# EAGLE design Main Titan V2 (EAGLE 9.4.2)
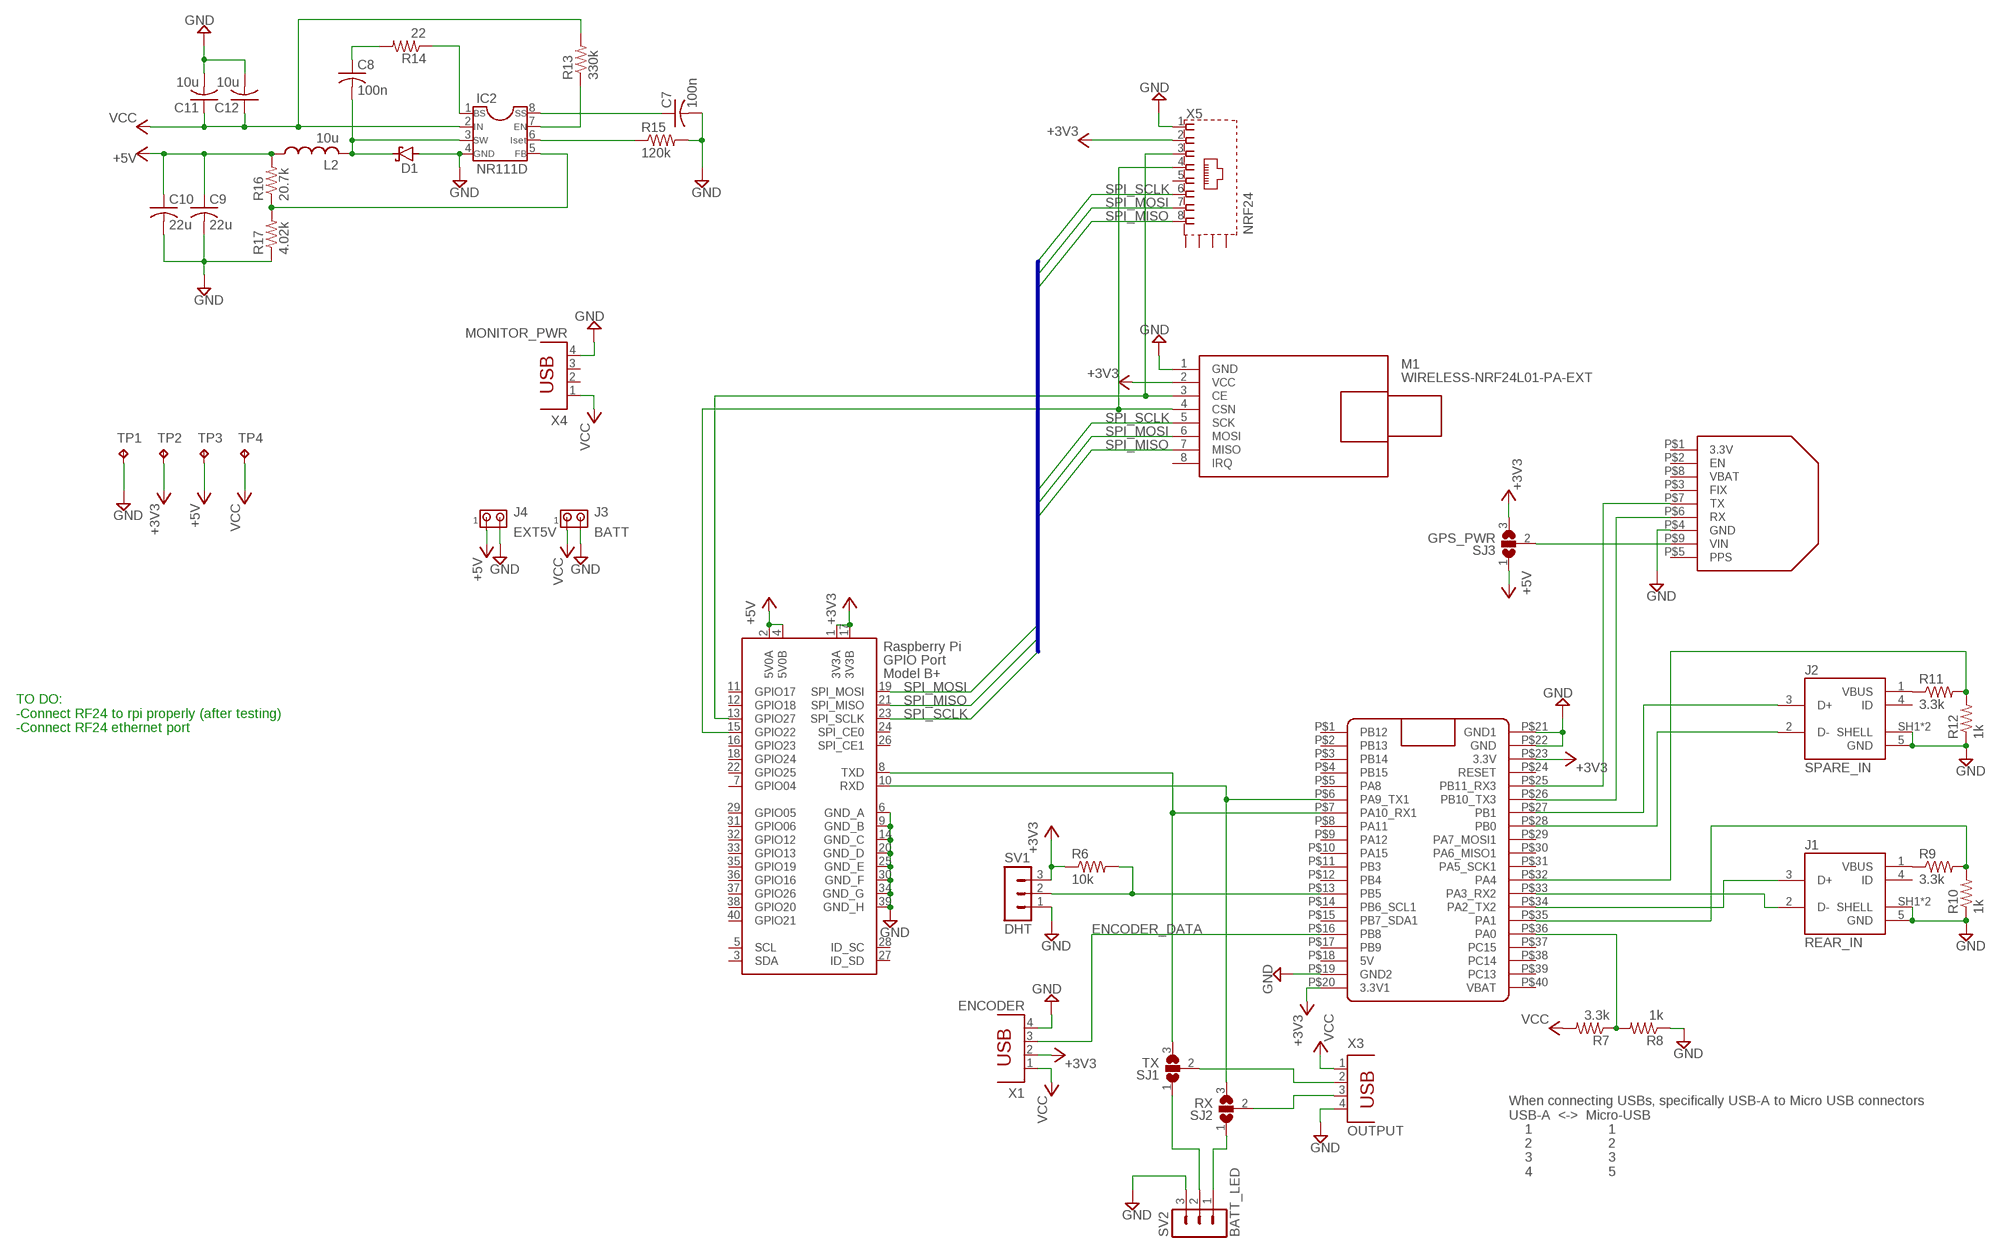
[diagram p0: schematic, sheet 1]

## Parts
C7  100n  C-US050-024X044  [C050-024X044]
C8  100n  C-US050-024X044  [C050-024X044]
C9  22u  C-US025-024X044  [C025-024X044]
C10  22u  C-US025-024X044  [C025-024X044]
C11  10u  C-US025-024X044  [C025-024X044]
C12  10u  C-US025-024X044  [C025-024X044]
D1  SCHOTTKY-DIODEC4111-15  [C4111-15]
IC2  NR111D  DIL8  [DIL08]
J1  REAR_IN  2172034-1  [TE_2172034-1]
J2  SPARE_IN  2172034-1  [TE_2172034-1]
J3  BATT  MTA02-156  [1X2MTA]
J4  EXT5V  MTA02-156  [1X2MTA]
L2  10u  WURTHINDUCTOR1  [INDRD650W105D880H1100B]
M1  WIRELESS-NRF24L01-PA-EXT  [WIRELESS-NRF24L01-PA-EXT]
R6  10k  R-US_0204/7  [0204/7]
R7  3.3k  R-US_0204/7  [0204/7]
R8  1k  R-US_0204/7  [0204/7]
R9  3.3k  R-US_0204/7  [0204/7]
R10  1k  R-US_0204/7  [0204/7]
R11  3.3k  R-US_0204/7  [0204/7]
R12  1k  R-US_0204/7  [0204/7]
R13  330k  R-US_0204/7  [0204/7]
R14  22  R-US_0204/7  [0204/7]
R15  120k  R-US_0204/7  [0204/7]
R16  20.7k  R-US_0204/7  [0204/7]
R17  4.02k  R-US_0204/7  [0204/7]
SJ1  TX  SJ2W  [SJ_2]
SJ2  RX  SJ2W  [SJ_2]
SJ3  GPS_PWR  SJ2W  [SJ_2]
SV1  DHT  MA03-1  [MA03-1]
SV2  BATT_LED  MA03-1  [MA03-1]
TP1  GND  TPTP20SQ  [TP20SQ]
TP2  3V3  TPTP20SQ  [TP20SQ]
TP3  5V  TPTP20SQ  [TP20SQ]
TP4  BAT  TPTP20SQ  [TP20SQ]
U$1  BLUE_PILL  [BLUE_PILL]
U$3  ULTIMATE-GPS  [ULTIMATE_GPS]
X1  ENCODER  PN87520  [PN87520]
X2  RPI  RASPI_GPIO_B+#_BOX  [RASPI_GPIO_B+_BOX]
X3  OUTPUT  PN87520  [PN87520]
X4  MONITOR_PWR  PN87520  [PN87520]
X5  NRF24  RJ45-6L21-S  [RJ45-SHIELD1]

## Nets
25%LED: SJ1.1 SV2.2
50%LED: SJ2.1 SV2.1
+3V3: M1.2(VCC) R6.1 SJ3.3 SV1.3 TP2.TP U$1.P$20(3.3V1) U$1.P$23(3.3V) X1.2 X2.1(3V3A) X2.17(3V3B) X5.2
+5V: C9.1 C10.1 J4.1 L2.1 R16.2 SJ3.1 TP3.TP X2.2(5V0A) X2.4(5V0B)
BATT_LVL: R7.1 R8.2 U$1.P$36(PA0)
DHT: R6.2 SV1.2 U$1.P$13(PB5)
ENCODER_DATA: U$1.P$16(PB8) X1.3
GND: C7.2 C9.2 C10.2 C11.2 C12.2 D1.A IC2.4(GND) J1.5(GND) J1.SH1(SHELL) J1.SH2(SHELL) J2.5(GND) J2.SH1(SHELL) J2.SH2(SHELL) J3.2 J4.2 M1.1(GND) R8.1 R10.1 R12.1 R15.2 R17.1 SV1.1 SV2.3 TP1.TP U$1.P$19(GND2) U$1.P$21(GND1) U$1.P$22(GND) U$3.P$4(GND) X1.4 X2.6(GND_A) X2.9(GND_B) X2.14(GND_C) X2.20(GND_D) X2.25(GND_E) X2.30(GND_F) X2.34(GND_G) X2.39(GND_H) X3.4 X4.4 X5.1
GPS_RX: U$1.P$26(PB10_TX3) U$3.P$6(RX)
GPS_TX: U$1.P$25(PB11_RX3) U$3.P$7(TX)
N$1: M1.3(CE) X2.13(GPIO27) X5.3
N$2: M1.4(CSN) X2.15(GPIO22) X5.4
N$3: SJ1.2 X3.2
N$4: SJ3.2 U$3.P$9(VIN)
N$5: SJ2.2 X3.3
N$14: IC2.5(FB) R16.1 R17.2
N$15: J1.1(VBUS) R9.1
N$17: J2.1(VBUS) R11.1
N$19: C8.2 D1.C IC2.3(SW) L2.2
N$22: C8.1 R14.2
N$23: C7.1 IC2.8(SS)
N$24: IC2.6(ISET) R15.1
N$25: IC2.7(EN) R13.1
N$26: IC2.1(BS) R14.1
REARBATT: R9.2 R10.2 U$1.P$35(PA1)
REARRX: J1.3(D+) U$1.P$34(PA2_TX2)
REARTX: J1.2(D-) U$1.P$33(PA3_RX2)
RPI_RX: SJ2.3 U$1.P$6(PA9_TX1) X2.10(RXD)
RPI_TX: SJ1.3 U$1.P$7(PA10_RX1) X2.8(TXD)
SPAREBATT: R11.2 R12.2 U$1.P$32(PA4)
SPARELED1: J2.3(D+) U$1.P$27(PB1)
SPARELED2: J2.2(D-) U$1.P$28(PB0)
SPI_MISO: M1.7(MISO) X2.21(SPI_MISO) X5.8
SPI_MOSI: M1.6(MOSI) X2.19(SPI_MOSI) X5.7
SPI_SCLK: M1.5(SCK) X2.23(SPI_SCLK) X5.6
VCC: C11.1 C12.1 IC2.2(IN) J3.1 R7.2 R13.2 TP4.TP X1.1 X3.1 X4.1
Unconnected: J1.4(ID) J2.4(ID) M1.8(IRQ) U$1.P$1(PB12) U$1.P$2(PB13) U$1.P$3(PB14) U$1.P$4(PB15) U$1.P$5(PA8) U$1.P$8(PA11) U$1.P$9(PA12) U$1.P$10(PA15) U$1.P$11(PB3) U$1.P$12(PB4) U$1.P$14(PB6_SCL1) U$1.P$15(PB7_SDA1) U$1.P$17(PB9) U$1.P$18(5V) U$1.P$24(RESET) U$1.P$29(PA7_MOSI1) U$1.P$30(PA6_MISO1) U$1.P$31(PA5_SCK1) U$1.P$37(PC15) U$1.P$38(PC14) U$1.P$39(PC13) U$1.P$40(VBAT) U$3.P$2(EN) U$3.P$3(FIX) U$3.P$5(PPS) U$3.P$8(VBAT) X2.3(SDA) X2.5(SCL) X2.7(GPIO04) X2.11(GPIO17) X2.12(GPIO18) X2.16(GPIO23) X2.18(GPIO24) X2.22(GPIO25) X2.24(SPI_CE0) X2.26(SPI_CE1) X2.27(ID_SD) X2.28(ID_SC) X2.29(GPIO05) X2.31(GPIO06) X2.32(GPIO12) X2.33(GPIO13) X2.35(GPIO19) X2.36(GPIO16) X2.37(GPIO26) X2.38(GPIO20) X2.40(GPIO21) X4.2 X4.3 X5.5 X5.S1(S) X5.S2(S) X5.S3(S) X5.S4(S)

## Buses
SPI_MISO,SPI_MOSI,SPI_SCLK

## Notes on the sheet
- TO DO:
  -Connect RF24 to rpi properly (after testing)
  -Connect RF24 ethernet port
- When connecting USBs, specifically USB-A to Micro USB connectors
  USB-A  <->  Micro-USB
      1                   1
      2                   2
      3                   3
      4                   5

## Power pins joined to a net without a drawn wire
3.3V: U$3.P$1(3.3V)

## Library data of the parts
C7-C12 = rcl:C-US: CAPACITOR, American symbol; SPICEPREFIX: C
D1 = diode:SCHOTTKY-DIODE: Schottky Diode
IC2 = NR111D:DIL8: Dual In Line / Socket
J1 J2 = 2172034-1:2172034-1: CONN RCPT USB MINI B 2.0 PCB R/A; COMMENT: 2172034-1; DESCRIPTION: Conn Mini USB Type B RCP 5 POS 0.8mm Solder RA Thru-Hole 5 Terminal 1 Port Box/Tray; DIGI-KEY_PART_NUMBER: A135698-ND; DIGI-KEY_PURCHASE_URL: https://www.digikey.com/product-detail/en/te-connectivity-amp-connectors/2172034-1/A135698-ND/5592056?utm_source=snapeda&utm_medium=aggregator&utm_campaign=symbol; EU_ROHS_COMPLIANCE: Compliant; MF: TE Connectivity; MP: 2172034-1; PACKAGE: None; TE_PURCHASE_URL: https://www.te.com/usa-en/product-2172034-1.html?te_bu=Cor&te_type=disp&te_campaign=seda_glo_cor-seda-global-disp-prtnr-fy19-seda-model-bom-cta_sma-317_1&elqCampaignId=32493
J3 J4 = con-amp:MTA02-156: AMP connector
L2 = NR111D:WURTHINDUCTOR
M1 = diy-modules:WIRELESS-NRF24L01-PA-EXT: 2.4 GHz Wireless Module based on NRF24L01 chip with preamplifier and external antenna Click here to find device on ebay.com <http://www.ebay.com/sch/nrf24l01+pa+lna+sma>
R6-R17 = rcl:R-US_: RESISTOR, American symbol; SPICEPREFIX: R
SJ1-SJ3 = jumper:SJ2W: SMD solder JUMPER
SV1 SV2 = con-lstb:MA03-1: PIN HEADER; OC_FARNELL: unknown; OC_NEWARK: unknown
TP1-TP4 = testpad:TP: Test pad
U$1 = BluePill:BLUE_PILL
U$3 = diy-modules:ULTIMATE-GPS
X1 X3 X4 = con-berg:PN87520: BERG USB connector; OC_FARNELL: unknown; OC_NEWARK: unknown
X2 = raspberrypi_bastelstube_v13:RASPI_GPIO_B+#: 2x20 header connector, all pins connected
X5 = con-tycoelectronics:RJ45*2: RJ45 Low Profile Shield Type 2 For all RJ45 L, LC, LCT and X Series Models Source: www.tycoelectronics.com .. ENG_DS_1654001_1099_RJ_L_0507.pdf; OC_FARNELL: unknown; OC_NEWARK: unknown

## Board
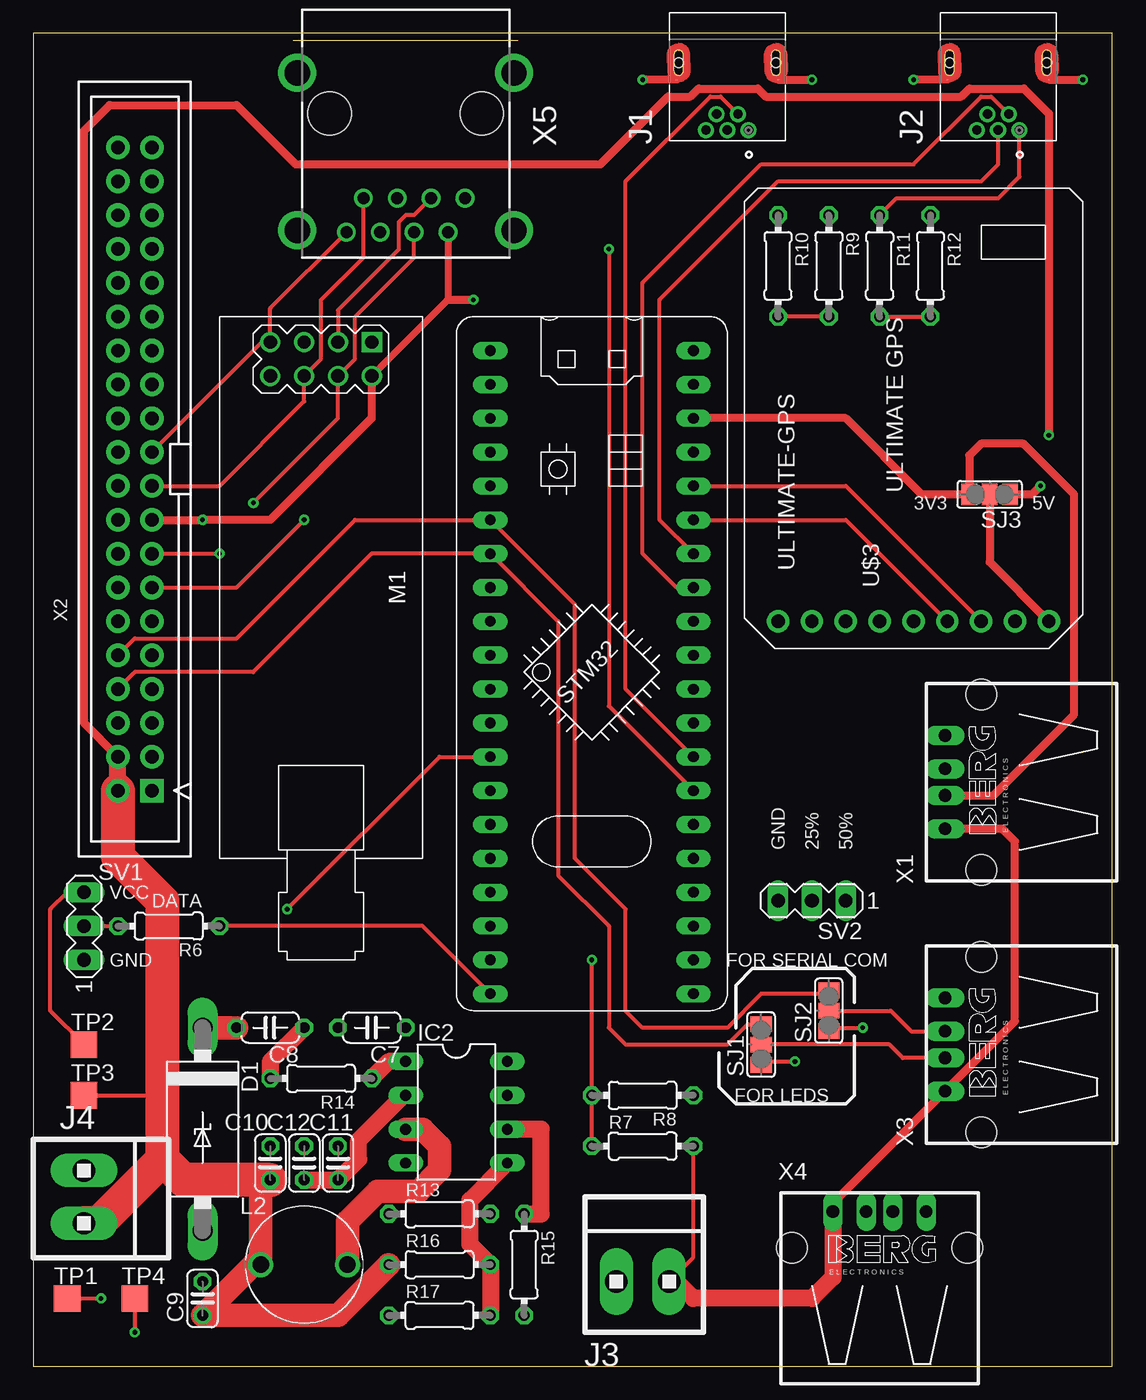
[diagram p1: board, top side]
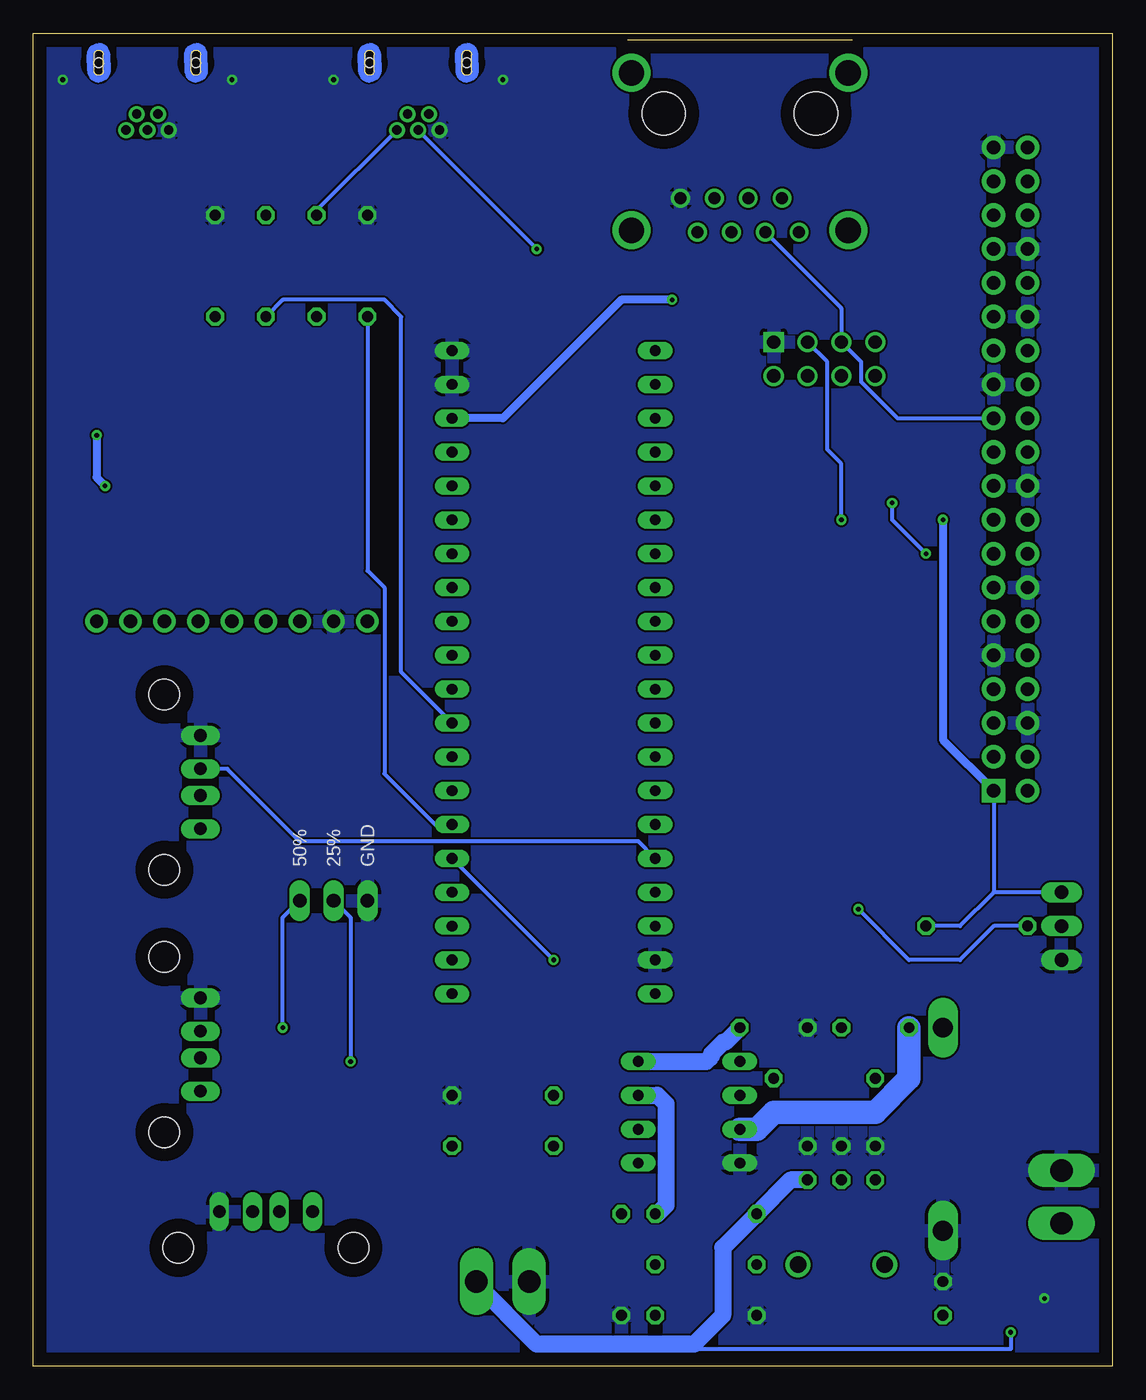
[diagram p2: board, bottom side, seen from below]

Size 80.95 x 100 mm. Coordinates in mm from the lower left corner, seen from the top.
Outline: 0,0 80.95,0 80.95,100 0,100 0,0
Copper layers (1*16): Top 0.035mm / dielectric 1.5mm / Bottom 0.035mm
Design rules "default": minimum track width 6mil, minimum drill 0.35mm, track to track 6mil, track to pad 6mil, pad to pad 6mil, via to via 6mil, smd to smd 6mil, copper to edge 40mil, drill to drill 6mil, minimum pad ring 10mil, minimum via ring 8mil, stop-mask expansion 4mil, vias tented up to drill 0mil, thermal gap 10mil

### Footprints (pad centres in the part's own frame; a part is rotated, then mirrored left to right if it is on the bottom)
C050-024X044 = drill 0.813 octagon: 1 -2.54,0; 2 2.54,0
C025-024X044 = drill 0.813 octagon: 1 -1.27,0; 2 1.27,0
C4111-15 = drill 1.499 long: A 7.62,0; C -7.62,0
DIL08 = drill 0.813 long: 1 -3.81,-3.81; 2 -1.27,-3.81; 3 1.27,-3.81; 4 3.81,-3.81; 5 3.81,3.81; 6 1.27,3.81; 7 -1.27,3.81; 8 -3.81,3.81
TE_2172034-1 = drill 0.7: 1 -5.05,-1.6; 2 -3.85,-0.8; 3 -5.05,0; 4 -3.85,0.8; 5 -5.05,1.6 | smd 0.1 x 0.1: SH1 -1.27,3.81; SH2 -1.27,-3.81 | hole 0.7: 0,3.65; 0,-3.65
1X2MTA = drill 1.676 long: 1 1.981,0; 2 -1.981,0
INDRD650W105D880H1100B = drill 1.25 pad 1.875: 1 -3.25,0; 2 3.25,0
WIRELESS-NRF24L01-PA-EXT = drill 1 square: 1 -18.415,3.81 | drill 1: 2 -15.875,3.81; 3 -18.415,1.27; 4 -15.875,1.27; 5 -18.415,-1.27; 6 -15.875,-1.27; 7 -18.415,-3.81; 8 -15.875,-3.81
0204/7 = drill 0.813 octagon: 1 -3.81,0; 2 3.81,0
SJ_2 = smd 1.168 x 1.6: 1 -1.524,0; 2 0,0; 3 1.524,0
MA03-1 = drill 1.016 long: 1 -2.54,0; 2 0,0; 3 2.54,0
TP20SQ = smd 2 x 2: TP 0,0
BLUE_PILL = drill 0.8 long: P$1 -7.62,15.24; P$2 -7.62,12.7; P$3 -7.62,10.16; P$4 -7.62,7.62; P$5 -7.62,5.08; P$6 -7.62,2.54; P$7 -7.62,0; P$8 -7.62,-2.54; P$9 -7.62,-5.08; P$10 -7.62,-7.62; P$11 -7.62,-10.16; P$12 -7.62,-12.7; P$13 -7.62,-15.24; P$14 -7.62,-17.78; P$15 -7.62,-20.32; P$16 -7.62,-22.86; P$17 -7.62,-25.4; P$18 -7.62,-27.94; P$19 -7.62,-30.48; P$20 -7.62,-33.02; P$21 7.62,15.24; P$22 7.62,12.7; P$23 7.62,10.16; P$24 7.62,7.62; P$25 7.62,5.08; P$26 7.62,2.54; P$27 7.62,0; P$28 7.62,-2.54; P$29 7.62,-5.08; P$30 7.62,-7.62; P$31 7.62,-10.16; P$32 7.62,-12.7; P$33 7.62,-15.24; P$34 7.62,-17.78; P$35 7.62,-20.32; P$36 7.62,-22.86; P$37 7.62,-25.4; P$38 7.62,-27.94; P$39 7.62,-30.48; P$40 7.62,-33.02
ULTIMATE_GPS = drill 1 pad 1.676: P$1 0,0; P$2 0,2.54; P$3 0,5.08; P$4 0,7.62; P$5 0,10.16; P$6 0,-2.54; P$7 0,-5.08; P$8 0,-7.62; P$9 0,-10.16
PN87520 = drill 0.95 long: 1 -3.5,2.71; 2 -1,2.71; 3 1,2.71; 4 3.5,2.71 | hole 2.3: -6.57,0; 6.57,0
RASPI_GPIO_B+_BOX = drill 1 pad 1.778 square: 1 -24.13,-1.27 | drill 1 pad 1.778: 2 -24.13,1.27; 3 -21.59,-1.27; 4 -21.59,1.27; 5 -19.05,-1.27; 6 -19.05,1.27; 7 -16.51,-1.27; 8 -16.51,1.27; 9 -13.97,-1.27; 10 -13.97,1.27; 11 -11.43,-1.27; 12 -11.43,1.27; 13 -8.89,-1.27; 14 -8.89,1.27; 15 -6.35,-1.27; 16 -6.35,1.27; 17 -3.81,-1.27; 18 -3.81,1.27; 19 -1.27,-1.27; 20 -1.27,1.27; 21 1.27,-1.27; 22 1.27,1.27; 23 3.81,-1.27; 24 3.81,1.27; 25 6.35,-1.27; 26 6.35,1.27; 27 8.89,-1.27; 28 8.89,1.27; 29 11.43,-1.27; 30 11.43,1.27; 31 13.97,-1.27; 32 13.97,1.27; 33 16.51,-1.27; 34 16.51,1.27; 35 19.05,-1.27; 36 19.05,1.27; 37 21.59,-1.27; 38 21.59,1.27; 39 24.13,-1.27; 40 24.13,1.27
RJ45-SHIELD1 = drill 0.9 pad 1.4: 1 -4.445,6.35; 2 -3.175,8.89; 3 -1.905,6.35; 4 -0.635,8.89; 5 0.635,6.35; 6 1.905,8.89; 7 3.175,6.35; 8 4.445,8.89 | drill 1.9 pad 2.5: S1 -8.128,-3.048; S2 8.128,-3.048; S3 -8.128,8.76; S4 8.128,8.76 | hole 3.251: -5.715,0; 5.715,0

### Placement (x,y rotation side)
C7  25.4,25.4 180 top
C8  17.78,25.4 180 top
C9  12.7,5.08 90 top
C10  17.78,15.24 90 top
C11  22.86,15.24 90 top
C12  20.32,15.24 90 top
D1  12.7,17.78 270 top
IC2  31.75,19.05 270 top
J1  52.07,97.79 90 top
J2  72.39,97.79 90 top
J3  45.72,6.35 0 top
J4  3.81,12.7 270 top
L2  20.32,7.62 0 top
M1  21.59,58.42 270 top
R6  10.16,33.02 180 top
R7  45.72,16.51 0 top
R8  45.72,20.32 180 top
R9  59.69,82.55 270 top
R10  55.88,82.55 270 top
R11  63.5,82.55 270 top
R12  67.31,82.55 270 top
R13  30.48,11.43 180 top
R14  21.59,21.59 180 top
R15  36.83,7.62 270 top
R16  30.48,7.62 180 top
R17  30.48,3.81 0 top
SJ1  54.61,24.13 90 top
SJ2  59.69,26.67 90 top
SJ3  71.75,65.41 180 top
SV1  3.81,33.02 90 top
SV2  58.42,34.92 180 top
TP1  2.54,5.08 0 top
TP2  3.81,24.13 0 top
TP3  3.81,20.32 0 top
TP4  7.62,5.08 0 top
U$1  41.91,60.96 0 top
U$3  66.04,55.88 90 top
X1  71.12,43.81 90 top
X2  7.62,67.31 90 top
X3  71.12,24.13 90 top
X4  63.5,8.89 0 top
X5  27.94,93.98 180 top

### Tracks (layer width: path | path; a pad name or v marks a point on that pad's centre or on a via)
25%LED  (via drill 0.35)
  Top 0.305: SJ1.1 54.86,22.86 v57.15,22.86
  Bottom 0.305: SV2.2 57.15,33.66 v57.15,22.86
50%LED  (via drill 0.35)
  Top 0.305: SJ2.1 59.94,25.4 v62.23,25.4
  Bottom 0.305: v62.23,25.4 62.23,33.66 SV2.1
+3V3  (via drill 0.35)
  Top 0.305: U$1.P$20 29.21,33.02 R6.1 | TP2.TP 1.27,26.67 1.27,34.29 2.54,35.56 SV1.3
  Top 0.508: M1.2 31.11,80.01 X5.2
  Top 0.61: M1.2 25.4,71.12 17.78,63.5 v12.7,63.5 X2.17 | U$1.P$23 60.96,71.12 66.67,65.41 SJ3.3 70.23,68.33 71.12,69.22 74.3,69.22 78.11,65.41 78.11,48.9 72.03,42.81 X1.2 | 31.11,80.01 v33.02,80.01
  Bottom 0.305: SV1.3 8.89,35.56 | R6.1 11.43,33.02 8.89,35.56 | X2.1 8.89,35.56
  Bottom 0.61: v12.7,63.5 12.7,46.99 X2.1 | v33.02,80.01 36.83,80.01 45.72,71.12 U$1.P$23
+5V  (via drill 0.35)
  Top 0.305: TP3.TP 9.7,20.32
  Top 0.61: X2.4 3.81,48.26 3.81,92.71 5.71,94.61 15.24,94.61 19.68,90.17 42.55,90.17 47.62,95.25 49.3,95.25 49.91,95.86 54.35,95.86 54.96,95.25 69.62,95.25 70.23,95.86 74.32,95.86 76.2,93.98 v76.2,69.85 | v75.56,66.04 74.93,65.41 SJ3.1
  Top 1.27: X2.2 X2.4 | L2.1 16.51,7.62
  Top 1.778: R16.2 22.86,3.81 C9.1 16.51,7.62 | L2.1 17.07,13.26 C10.1
  Top 2.54: J4.1 3.82,10.73 4.91,10.73 9.7,15.53 | 9.7,15.53 9.7,20.32 9.7,34.87 6.35,38.23 X2.2 | C10.1 11.26,13.97 9.7,15.53
  Bottom 0.61: v76.2,69.85 76.2,66.67 v75.56,66.04
BATT_LVL  (via drill 0.35)
  Top 0.305: R7.1 R8.2 v41.91,30.48
  Bottom 0.305: v41.91,30.48 U$1.P$36
DHT  (via drill 0.35)
  Top 0.305: SV1.2 R6.2 | v19.05,34.29 30.48,45.72 U$1.P$13
  Bottom 0.305: R6.2 8.89,33.02 11.43,30.48 15.24,30.48 v19.05,34.29
ENCODER_DATA
  Bottom 0.305: U$1.P$16 35.56,39.37 60.96,39.37 66.41,44.81 X1.3
GND  (via drill 0.35)
  Top 0.305: TP1.TP v5.08,5.08
  Top 0.61: J1.SH1 v45.72,96.52 | J1.SH2 v58.42,96.52 | J2.SH1 v66.04,96.52 | J2.SH2 v78.74,96.52
  pour Bottom: 0,100.33 0,0 82.55,0 82.55,100.33
GPS_RX
  Top 0.305: U$1.P$26 60.96,63.5 U$3.P$6
GPS_TX
  Top 0.305: U$1.P$25 60.96,66.04 U$3.P$7
N$1  (via drill 0.35)
  Top 0.305: X5.3 28.57,86.36 27.94,86.36 27.43,85.84 27.43,83.78 22.86,79.22 M1.3 | X2.13 15.24,58.42 v20.32,63.5
  Bottom 0.305: v20.32,63.5 20.32,67.72 21.38,68.78 21.38,75.35 M1.3
N$2  (via drill 0.35)
  Top 0.305: X5.4 28.57,83.19 24.13,78.74 24.13,75.56 M1.4 22.86,71.12 v16.51,64.77 | X2.15 v13.97,60.96
  Bottom 0.305: v13.97,60.96 16.51,63.5 v16.51,64.77
N$3
  Top 0.305: X3.2 65.23,23.13 64.23,24.13 SJ1.2
N$4
  Top 0.61: SJ3.2 71.75,60.33 U$3.P$9
N$5
  Top 0.305: SJ2.2 64.33,26.67 65.87,25.13 X3.3
N$14
  Top 1.27: R17.2 R16.1 32.77,9.14 32.77,12.45 IC2.5
N$15
  Bottom 0.305: J1.1 59.69,86.72 R9.1
N$17
  Top 0.305: R11.1 64.77,87.63 72.39,87.63 73.99,89.23 J2.1
N$19
  Top 1.778: C8.2 D1.C | L2.2 23.57,10.87 25.83,13.13 28.9,13.13 30.48,14.71 30.48,16.51 29.21,17.78 IC2.3
  Bottom 1.778: C8.2 15.24,21.59 17.78,19.05 25.4,19.05 26.67,17.78 IC2.3
N$22
  Top 1.27: C8.1 17.78,22.86 R14.2
N$23
  Bottom 1.27: IC2.8 30.48,22.86 30.05,23.29 30.05,23.46 29.2,24.31 29.03,24.31 C7.1
N$24
  Top 1.27: R15.1 38.1,11.43 38.1,17.78 IC2.6
N$25
  Bottom 1.27: R13.1 34.12,11.43 33.45,12.1 33.45,19.65 34.12,20.32 IC2.7
N$26
  Top 1.27: IC2.1 26.67,22.86 R14.1
REARBATT
  Top 0.305: R9.2 R10.2
  Bottom 0.305: R10.2 55.88,59.69 54.61,58.42 54.61,44.45 50.8,40.64 U$1.P$35
REARRX  (via drill 0.35)
  Top 0.305: v43.18,83.82 43.18,49.53 U$1.P$34
  Bottom 0.305: J1.3 43.18,83.85 v43.18,83.82
REARTX
  Top 0.305: U$1.P$33 44.45,50.8 44.45,88.9 50.8,95.25 51.56,95.25 J1.2
RPI_RX
  Top 0.305: X2.10 7.62,54.61 15.24,54.61 24.13,63.5 U$1.P$6 40.64,57.15 40.64,38.1 44.45,34.29 44.45,26.67 45.72,25.4 52.07,25.4 54.61,27.94 59.44,27.94 SJ2.3
RPI_TX
  Top 0.305: X2.8 7.62,52.07 16.51,52.07 25.4,60.96 U$1.P$7 39.37,55.88 39.37,36.83 43.18,33.02 43.18,25.4 44.45,24.13 52.07,24.13 53.59,25.65 SJ1.3
SPAREBATT
  Top 0.305: R11.2 R12.2
  Bottom 0.305: U$1.P$32 53.34,52.07 53.34,78.74 54.61,80.01 62.23,80.01 R11.2
SPARELED1
  Top 0.305: U$1.P$27 46.99,63.5 46.99,80.01 55.88,88.9 71.12,88.9 72.39,90.17 J2.3
SPARELED2
  Top 0.305: U$1.P$28 48.26,58.42 45.72,60.96 45.72,81.28 54.61,90.17 66.04,90.17 71.12,95.25 71.88,95.25 J2.2
SPI_MISO
  Top 0.305: X5.8 17.78,79.38 M1.7 17.14,76.83 X2.21
SPI_MOSI
  Top 0.305: X5.7 24.77,83.19 21.59,80.01 21.59,75.56 M1.6 20.32,72.39 13.97,66.04 X2.19
SPI_SCLK
  Bottom 0.305: X5.6 20.32,79.38 M1.5 18.84,75.35 18.84,73.86 16.1,71.12 X2.23
VCC  (via drill 0.35)
  Top 0.305: J3.1 47.98,6.63 49.53,8.18 R7.2 | TP4.TP v7.62,2.54
  Top 0.61: X1.1 72.72,40.31 73.66,39.37 73.66,25.88 X3.1 60,12.22 X4.1
  Top 1.27: X4.1 60,6.66 58.42,5.08 49.53,5.08 47.98,6.63 | IC2.2 27.77,20.32 24.41,16.96 24.41,15.52 C11.1 C12.1
  Bottom 0.305: v7.62,2.54 7.62,1.27 30.99,1.27 31.37,1.65
  Bottom 1.27: J3.1 47.7,6.16 43.19,1.65 31.37,1.65 29.21,3.81 29.21,8.89 R13.2 24.13,13.97 C11.1

### Text on the board
tPlace: GND | 25% | 50% | VCC | DATA | GND
bPlace: GND | 25% | 50%
tNames: 3V3 | 5V | FOR SERIAL COM | FOR LEDS
tValues: NOTE: RIBBON CABLE IS / MEANT TO GO ACROSS PCB / (IT SHOULD COVER THIS TEXT) | 3V3 | 5V | GND | BAT
bValues: GND | GND | 3V3 | GPS_TX | PI_RX | GPS_RX | PI_TX | S_LED1 | S_LED2 | GND | GPS_RX | GPS_TX | VIN | University of Toronto / Human-Powered Vehicles Design Team / Titan PCB Rev.1 / hpv@hpvdt.skule.ca | S_BATT | DHT | R_TX | R_RX | ENCODER | BATT | GND | 3V3 | - | + | - | +